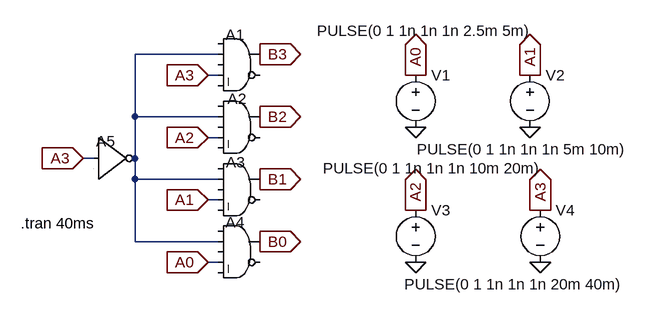
[diagram p0: schematic ReLU.asc]
ReLU.asc, the LTspice schematic file:
Version 4
SHEET 1 880 680
WIRE -48 -32 -176 -32
WIRE -48 0 -64 0
WIRE -176 64 -176 -32
WIRE -48 64 -176 64
WIRE -48 96 -64 96
WIRE -240 128 -256 128
WIRE -176 128 -176 64
WIRE -176 160 -176 128
WIRE -48 160 -176 160
WIRE -48 192 -64 192
WIRE -176 256 -176 160
WIRE -48 256 -176 256
WIRE -48 288 -64 288
FLAG -64 0 A3
IOPIN -64 0 In
FLAG -64 96 A2
IOPIN -64 96 In
FLAG -64 192 A1
IOPIN -64 192 In
FLAG -64 288 A0
IOPIN -64 288 In
FLAG 16 -32 B3
IOPIN 16 -32 Out
FLAG 16 64 B2
IOPIN 16 64 Out
FLAG 16 160 B1
IOPIN 16 160 Out
FLAG 16 256 B0
IOPIN 16 256 Out
FLAG 448 208 A3
IOPIN 448 208 Out
FLAG 256 208 A2
IOPIN 256 208 Out
FLAG 432 0 A1
IOPIN 432 0 Out
FLAG 256 0 A0
IOPIN 256 0 Out
FLAG 256 80 0
FLAG 432 80 0
FLAG 448 288 0
FLAG 256 288 0
FLAG -256 128 A3
IOPIN -256 128 In
SYMBOL Digital\\and -16 -80 R0
WINDOW 0 -21 18 Left 2
SYMATTR InstName A1
SYMBOL Digital\\and -16 16 R0
WINDOW 0 -18 20 Left 2
SYMATTR InstName A2
SYMBOL Digital\\and -16 112 R0
WINDOW 0 -20 22 Left 2
SYMATTR InstName A3
SYMBOL Digital\\and -16 208 R0
WINDOW 0 -21 18 Left 2
SYMATTR InstName A4
SYMBOL Digital\\inv -240 64 R0
WINDOW 0 4 38 Left 2
SYMATTR InstName A5
SYMBOL voltage 256 -16 R0
WINDOW 3 -152 -52 Left 2
WINDOW 123 0 0 Left 0
WINDOW 39 0 0 Left 0
SYMATTR Value PULSE(0 1 1n 1n 1n 2.5m 5m)
SYMATTR InstName V1
SYMBOL voltage 432 -16 R0
WINDOW 3 -174 130 Left 2
WINDOW 123 0 0 Left 0
WINDOW 39 0 0 Left 0
SYMATTR Value PULSE(0 1 1n 1n 1n 5m 10m)
SYMATTR InstName V2
SYMBOL voltage 256 192 R0
WINDOW 3 -143 -49 Left 2
WINDOW 123 0 0 Left 0
WINDOW 39 0 0 Left 0
SYMATTR Value PULSE(0 1 1n 1n 1n 10m 20m)
SYMATTR InstName V3
SYMBOL voltage 448 192 R0
WINDOW 3 -209 130 Left 2
WINDOW 123 0 0 Left 0
WINDOW 39 0 0 Left 0
SYMATTR Value PULSE(0 1 1n 1n 1n 20m 40m)
SYMATTR InstName V4
TEXT -352 228 Left 2 !.tran 40ms

The netlist it stands for:
* ReLU.asc
A1 0 N001 0 A3 0 0 B3 0 AND
A2 0 N001 0 A2 0 0 B2 0 AND
A3 0 N001 0 A1 0 0 B1 0 AND
A4 0 N001 0 A0 0 0 B0 0 AND
A5 A3 0 0 0 0 N001 0 0 BUF
V1 A0 0 PULSE(0 1 1n 1n 1n 2.5m 5m)
V2 A1 0 PULSE(0 1 1n 1n 1n 5m 10m)
V3 A2 0 PULSE(0 1 1n 1n 1n 10m 20m)
V4 A3 0 PULSE(0 1 1n 1n 1n 20m 40m)
.tran 40ms
.backanno
.end